# Altium schematic sheet conn_usbc.SchDoc
size A
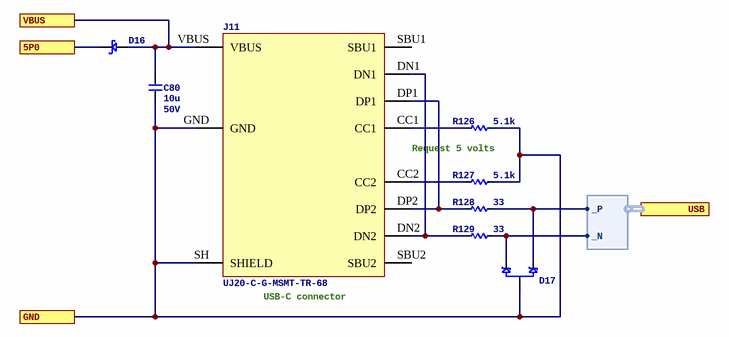
[diagram p0: conn_usbc.SchDoc]

## Parts
C80  Capacitance: 10u  Voltage Rating: 50V  [C1206]  (hidden comment: CL31B106KBHNNNE)
D16  MSS2P2-M3/89A  [ESMP]  (value not drawn)
D17  PESD2USB3UX  [3SOT23]  (value not drawn)
J11  UJ20-C-G-MSMT-TR-68  [CONN_USBC_UJ20-C-G-MSMT-TR-68]
R126  value 5.1k  [R0402]  (hidden comment: 0402WGF5101TCE)
R127  value 5.1k  [R0402]  (hidden comment: 0402WGF5101TCE)
R128  value 33  [R0402]  (hidden comment: 0402WGF330JTCE)
R129  value 33  [R0402]  (hidden comment: 0402WGF330JTCE)

## Ports
5P0, GND, USB (harness DIFF), VBUS

## Harnesses
DIFF: _P, _N

## Nets
5P0: D16.1 ; port 5P0
GND: C80.2 D17.3 J11.GND J11.SH(SHIELD) R126.1 R127.1 ; port GND
VBUS: C80.1 D16.2 J11.VBUS ; port VBUS
NetD17_1: D17.1 R129.1 ; port USB._N
NetD17_2: D17.2 R128.1 ; port USB._P
NetJ11_CC1: J11.CC1 R126.2
NetJ11_CC2: J11.CC2 R127.2
NetJ11_DN1: J11.DN1 J11.DN2 R129.2
NetJ11_DP1: J11.DP1 J11.DP2 R128.2

Not connected (* = marked no-connect by the designer): J11 SBU1 SBU2

## Notes on the sheet
- Request 5 volts
- (near J11) USB-C connector

## Library data of the parts
C80 = CL31B106KBHNNNE: Manufacturer: Samsung Electro-Mechanics; Dielectric: X7R; ComponentLink1URL: https://wmsc.lcsc.com/wmsc/upload/file/pdf/v2/lcsc/1810221111_Samsung-Electro-Mechanics-CL31B106KBHNNNE_C89632.pdf; ComponentLink1Description: Datasheet; Manufacturer Part Number: CL31B106KBHNNNE; Package: 1206; Supplier 2: LCSC; Supplier Part Number 2: C89632
D16 = SCHOTTKY_MSS2P2-M3/89A: DIODE SCHOTTKY 20V 2A MICROSMP; Manufacturer: Vishay Semiconductor Diodes Division; Supplier 1: Digikey; Manufacturer Part Number: MSS2P2-M3/89A; ComponentLink1URL: http://www.vishay.com/docs/89054/mss2p3.pdf; ComponentLink1Description: Datasheet; Supplier Part Number 1: MSS2P2-M3/89AGICT-ND; Supplier 2: LCSC; Supplier Part Number 2: C2978531
D17 = TVS_PESD2USB3UX-T: DIODE ESD USB SOT-23; Manufacturer: Nexperia USA Inc.; Supplier 1: Digikey; Supplier Part Number 1: 1727-PESD2USB3UX-CT-ND; Manufacturer Part Number: PESD2USB3UX; Supplier 2: LCSC; Supplier Part Number 2: C3708426; ComponentLink1Description: Datasheet; ComponentLink1URL: https://assets.nexperia.com/documents/data-sheet/PESD2USB3UX-T.pdf
J11 = CONN_USBC_UJ20-C-G-MSMT-TR-68: USB-C (USB TYPE-C) USB 2.0 Receptacle Connector 24 (16+8 Dummy) Position Surface Mount, Right Angle; Through Hole; Manufacturer: Same Sky; ComponentLink1Description: Product page; ComponentLink1URL: https://www.sameskydevices.com/product/interconnect/connectors/usb-connectors/uj20-c-g-msmt-tr-68; ComponentLink2Description: Drawing; ComponentLink2URL: https://www.sameskydevices.com/product/resource/uj20-c-g-msmt-tr-68.pdf; Supplier 1: Digikey; Supplier Part Number 1: 2223-UJ20-C-G-MSMT-TR-68CT-ND; Manufacturer Part Number: UJ20-C-G-MSMT-TR-68; Supplier 2: LCSC; Supplier Part Number 2: C21943923
R126 R127 = 0402WGF5101TCE: Manufacturer: UNI-ROYAL(Uniroyal Elec); Tolerance: 1%; Temperature Coefficient: Â±100ppm/â„ƒ; Power Rating (mW): 62.5; ComponentLink1Description: Datasheet; ComponentLink1URL: https://wmsc.lcsc.com/wmsc/upload/file/pdf/v2/lcsc/2206010045_UNI-ROYAL-Uniroyal-Elec-0402WGF5101TCE_C25905.pdf; Manufacturer Part Number: 0402WGF5101TCE; Package: 0402; Supplier 2: LCSC; Supplier Part Number 2: C25905
R128 R129 = 0402WGF330JTCE: Manufacturer: UNI-ROYAL(Uniroyal Elec); Tolerance: 1%; Temperature Coefficient: Â±100ppm/â„ƒ; Power Rating (mW): 62.5; ComponentLink1Description: Datasheet; ComponentLink1URL: https://wmsc.lcsc.com/wmsc/upload/file/pdf/v2/lcsc/2205311900_UNI-ROYAL-Uniroyal-Elec-0402WGF330JTCE_C25105.pdf; Manufacturer Part Number: 0402WGF330JTCE; Package: 0402; Supplier 2: LCSC; Supplier Part Number 2: C25105